# Altium schematic sheet Enable.SchDoc
size A
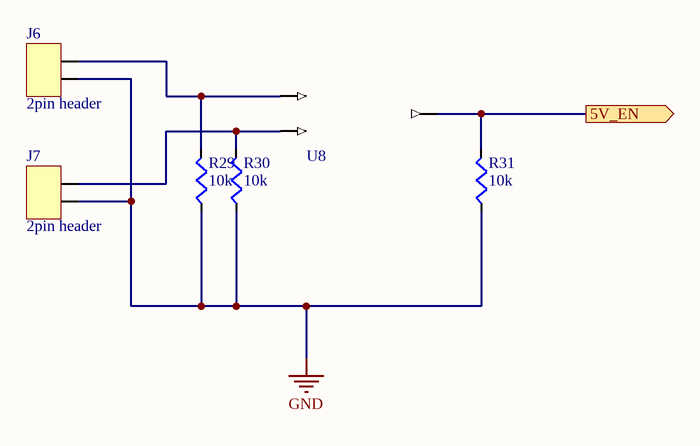
[diagram p0: Enable.SchDoc]

## Parts
J6  2pin header  [HEADERPINS_2x1]
J7  2pin header  [HEADERPINS_2x1]
R29  10k  [R0603]
R30  10k  [R0603]
R31  10k  [R0603]
U8  AND  (value not drawn)

## Ports
5V_EN (out)

## Nets
GND: J6.2 J7.2 R29.1 R30.1 R31.1
5V_EN: R31.2 U8.19 ; port 5V_EN
NetJ6_1: J6.1 R29.2 U8.17
NetJ7_1: J7.1 R30.2 U8.18

## Library data of the parts
J6 J7 = J2
R29-R31 = RC0603JR-0710KL: RES SMD 10K OHM 5% 1/10W 0603
U8 = MC74VHC1G08DFT2G: AND Gate 1-Element 2-IN CMOS Automotive 5-Pin SC-88A T/R; Manufacturer 1: ON Semiconductor; Quiescent Current: 1uA; Max Supply Voltage: 5.5V; Min Supply Voltage: 2V; Low Level Output Current: 8mA; Number of Circuits: 1; High Level Output Current: -8mA; Turn-On Delay Time: 16.5ns; Schmitt Trigger Input: No; Propagation Delay: 7.9ns; Number of Inputs: 2; Operating Supply Voltage: 3.75V; Supplier 1: Digi-Key; Supplier Part Number 1: MC74VHC1G08DFT2GOSCT-ND; Manufacturer Part Number 1: MC74VHC1G08DFT2G; RoHS: Yes; Category: Logic Gates; Stock 1: 12332; Pricing 1: 1=0.20000, 10=0.16800, 25=0.14040, 100=0.08890, 250=0.06864, 500=0.05850, 1000=0.03978 (USD); Mount: Surface Mount; Case/Package: SC; Number of Pins: 5; Contact Plating: Tin,Matte; Min Operating Temperature: -55°C; Max Operating Temperature: 125°C; Logic Function: AND GATE; Number of Elements: 1; Output Current: 8mA; Number of Gates: 1; Packaging: Tape and Reel; Package Quantity: 1; Number of Outputs: 1; Length: 2.2mm; Width: 1.35mm; Height: 1mm; Radiation Hardening: No; REACH SVHC: No SVHC; Lead Free: Lead Free; Halogen Free: Halogen Free; ComponentLink1URL: https://datasheet.ciiva.com/4819/mc74vhc1g08-d-94763-4819952.pdf?src-supplier=Mouser; ComponentLink1Description: https://datasheet.ciiva.com/4819/mc74vhc1g08-d-94763-4819952.pdf?src-supplier=Mouser; ComponentLink2URL: https://datasheet.ciiva.com/1871/mc74vhc1g08-d-1871334.pdf?src-supplier=Digi-Key; ComponentLink2Description: https://datasheet.ciiva.com/1871/mc74vhc1g08-d-1871334.pdf?src-supplier=Digi-Key; ComponentLink3URL: https://datasheet.ciiva.com/1871/mc74vhc1g08-d-1871335.pdf?src-supplier=Digi-Key; ComponentLink3Description: https://datasheet.ciiva.com/1871/mc74vhc1g08-d-1871335.pdf?src-supplier=Digi-Key; ComponentLink4URL: https://datasheet.ciiva.com/8277/mc74vhc1g08-d-8277815.pdf?src-supplier=Avnet; ComponentLink4Description: https://datasheet.ciiva.com/8277/mc74vhc1g08-d-8277815.pdf?src-supplier=Avnet; ComponentLink5URL: https://datasheet.ciiva.com/1871/mc74vhc1g08-d-1871336.pdf?src-supplier=Digi-Key; ComponentLink5Description: https://datasheet.ciiva.com/1871/mc74vhc1g08-d-1871336.pdf?src-supplier=Digi-Key; ComponentLink6URL: https://datasheet.ciiva.com/16455/mc74vhc1g08-d-16455451.pdf?src-supplier=Future+Electronics; ComponentLink6Description: https://datasheet.ciiva.com/16455/mc74vhc1g08-d-16455451.pdf?src-supplier=Future+Electronics